# EAGLE design pontEnH (EAGLE 4.16)
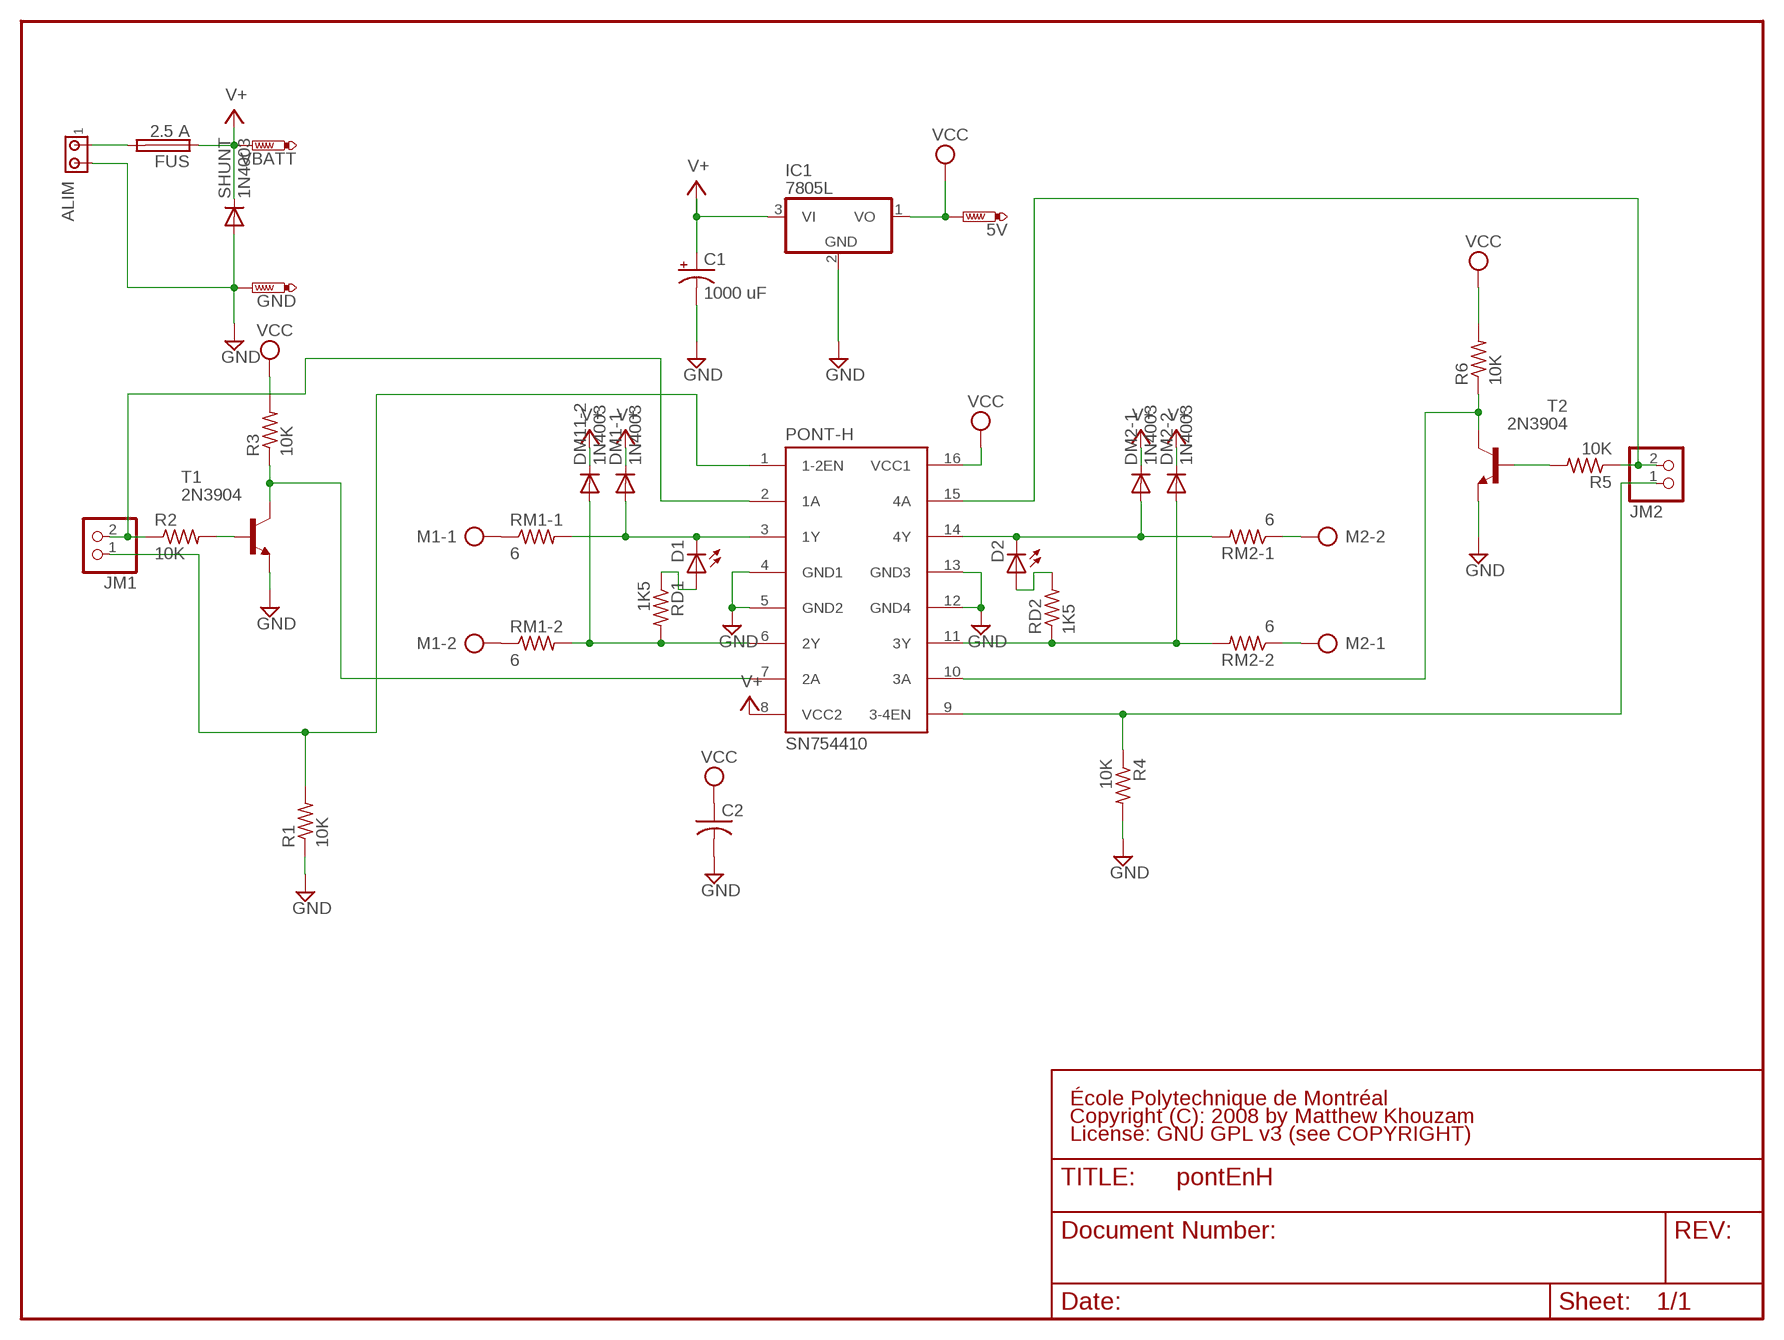
[diagram p0: schematic, sheet 1]

## Parts
5V  keystone_tp  PTR1PAD1-13  [P1-13]
ALIM  MTA02-100  [10X02MTA]
C1  1000 uF  CPOL-USE5-10.5  [E5-10,5]
C2  C-US050-030X075  [C050-030X075]
D1  LED5MM  [LED5MM]
D2  LED5MM  [LED5MM]
DM1-1  1N4003  1N4004  [DO41-10]
DM2-1  1N4003  1N4004  [DO41-10]
DM2-2  1N4003  1N4004  [DO41-10]
DM11-2  1N4003  1N4004  [DO41-10]
FUS  2.5 A  TR5  [TR5]
GND  keystone_tp  PTR1PAD1-13  [P1-13]
IC1  7805L  [TO92]
JM1  PINHD-1X2  [1X02]
JM2  PINHD-1X2  [1X02]
M1  AK300/2  [AK300/2]
M2  AK300/2  [AK300/2]
PONT-H  SN754410  L293E  [DIL16]
R1  10K  R-US_0207/10  [0207/10]
R2  10K  R-US_0207/10  [0207/10]
R3  10K  R-US_0207/10  [0207/10]
R4  10K  R-US_0207/10  [0207/10]
R5  10K  R-US_0207/10  [0207/10]
R6  10K  R-US_0207/10  [0207/10]
RD1  1K5  R-US_0207/10  [0207/10]
RD2  1K5  R-US_0207/10  [0207/10]
RM1-1  6  R-US_0613/5V  [P0613V]
RM1-2  6  R-US_0613/5V  [P0613V]
RM2-1  6  R-US_0613/5V  [P0613V]
RM2-2  6  R-US_0613/5V  [P0613V]
SHUNT  1N4003  1N4004  [DO41-10]
T1  2N3904  [TO92]
T2  2N3904  [TO92]
VBATT  keystone_tp  PTR1PAD1-13  [P1-13]

## Nets
_DIRG: PONT-H.10(3A) R6.1 T2.1(C)
EN-GAU: JM2.1 PONT-H.9(3-4EN) R4.1
EN_DR: JM1.1 PONT-H.1(1-2EN) R1.2
GND: ALIM.2 C1.- C2.2 GND.1(TP) IC1.2(GND) PONT-H.4(GND1) PONT-H.5(GND2) PONT-H.12(GND4) PONT-H.13(GND3) R1.1 R4.2 SHUNT.A T1.3(E) T2.3(E)
N$1: M2.2 RM2-1.1
N$2: M2.1 RM2-2.1
N$3: DM2-2.A PONT-H.11(3Y) RD2.1 RM2-2.2
N$5: D1.K(C) DM1-1.A PONT-H.3(1Y) RM1-1.2
N$7: M1.2 RM1-2.1
N$8: M1.1 RM1-1.1
N$9: D1.A RD1.1
N$10: D2.A RD2.2
N$11: DM11-2.A PONT-H.6(2Y) RD1.2 RM1-2.2
N$12: ALIM.1 FUS.2
N$13: D2.K(C) DM2-1.A PONT-H.14(4Y) RM2-1.2
N$14: PONT-H.7(2A) R3.1 T1.1(C)
N$15: R2.2 T1.2(B)
N$16: R5.2 T2.2(B)
N$22: JM2.2 PONT-H.15(4A) R5.1
N$23: JM1.2 PONT-H.2(1A) R2.1
V+: C1.+ DM1-1.C DM2-1.C DM2-2.C DM11-2.C FUS.1 IC1.3(VI) PONT-H.8(VCC2) SHUNT.C VBATT.1(TP)
VCC: 5V.1(TP) C2.1 IC1.1(VO) PONT-H.16(VCC1) R3.2 R6.2

## Notes on the sheet
- École Polytechnique de Montréal
- Copyright (C): 2008 by Matthew Khouzam
- License: GNU GPL v3 (see COPYRIGHT)

## Library data of the parts
5V GND VBATT = testpad:PTR1: TEST PIN
ALIM = con-amp:MTA02-100: AMP connector
C1 = rcl:CPOL-US: POLARIZED CAPACITOR, American symbol
C2 = rcl:C-US: CAPACITOR, American symbol
D1 D2 = led:LED: LED OSRAM: - CHIPLED LG R971, LG N971, LY N971, LG Q971, LY Q971, LO R971, LY R971 LH N974, LH R974 LS Q976, LO Q976, LY Q976 LO Q996 - Hyper CHIPLED LW Q18S LB Q993, LB Q99A, LB R99A - SideLED LS A670, LO A670, LY A670, LG A670, LP A670 LB A673, LV A673, LT A673, LW A673 LH A674 LY A675 LS A676, LA A676, LO A676, LY A676, LW A676 LS A679, LY A679, LG A679 - Hyper Micro SIDELED® LS Y876, LA Y876, LO Y876, LY Y876 LT Y87S - SmartLED LW L88C, LW L88S LB L89C, LB L89S, LG L890 LS L89K, LO L89K, LY L89K LS L896, LA L896, LO L896, LY L896 - TOPLED LS T670, LO T670, LY T670, LG T670, LP T670 LSG T670, LSP T670, LSY T670, LOP T670, LYG T670 LG T671, LOG T671, LSG T671 LB T673, LV T673, LT T673, LW T673 LH T674 LS T676, LA T676, LO T676, LY T676, LB T676, LH T676, LSB T676, LW T676 LB T67C, LV T67C, LT T67C, LS T67K, LO T67K, LY T67K, LW E67C LS E67B, LA E67B, LO E67B, LY E67B, LB E67C, LV E67C, LT E67C LW T67C LS T679, LY T679, LG T679 LS T770, LO T770, LY T770, LG T770, LP T770 LB T773, LV T773, LT T773, LW T773 LH T774 LS E675, LA E675, LY E675, LS T675 LS T776, LA T776, LO T776, LY T776, LB T776 LHGB T686 LT T68C, LB T68C - Hyper Mini TOPLED® LB M676 - Mini TOPLED Santana® LG M470 LS M47K, LO M47K, LY M47K Source: http://www.osram.convergy.de/
DM1-1 DM2-1 DM2-2 DM11-2 SHUNT = diode:1N4004: DIODE general purpose rectifier, 1 A
FUS = fuse:TR5: FUSE Wickmann
IC1 = linear:78*: Positive VOLTAGE REGULATOR Source: http://cache.national.com/ds/LM/LM78L05.pdf http://www.fairchildsemi.com/ds/LM/LM7805.pdf
JM1 JM2 = pinhead:PINHD-1X2: PIN HEADER
M1 M2 = con-ptr500:AK300/2: CONNECTOR
PONT-H = texas:L293E: TI DEVICE
R1-R6 RD1 RD2 RM1-1 RM1-2 RM2-1 RM2-2 = rcl:R-US_: RESISTOR, American symbol
T1 T2 = transistor:2N3904: NPN TRANSISTOR

## Board
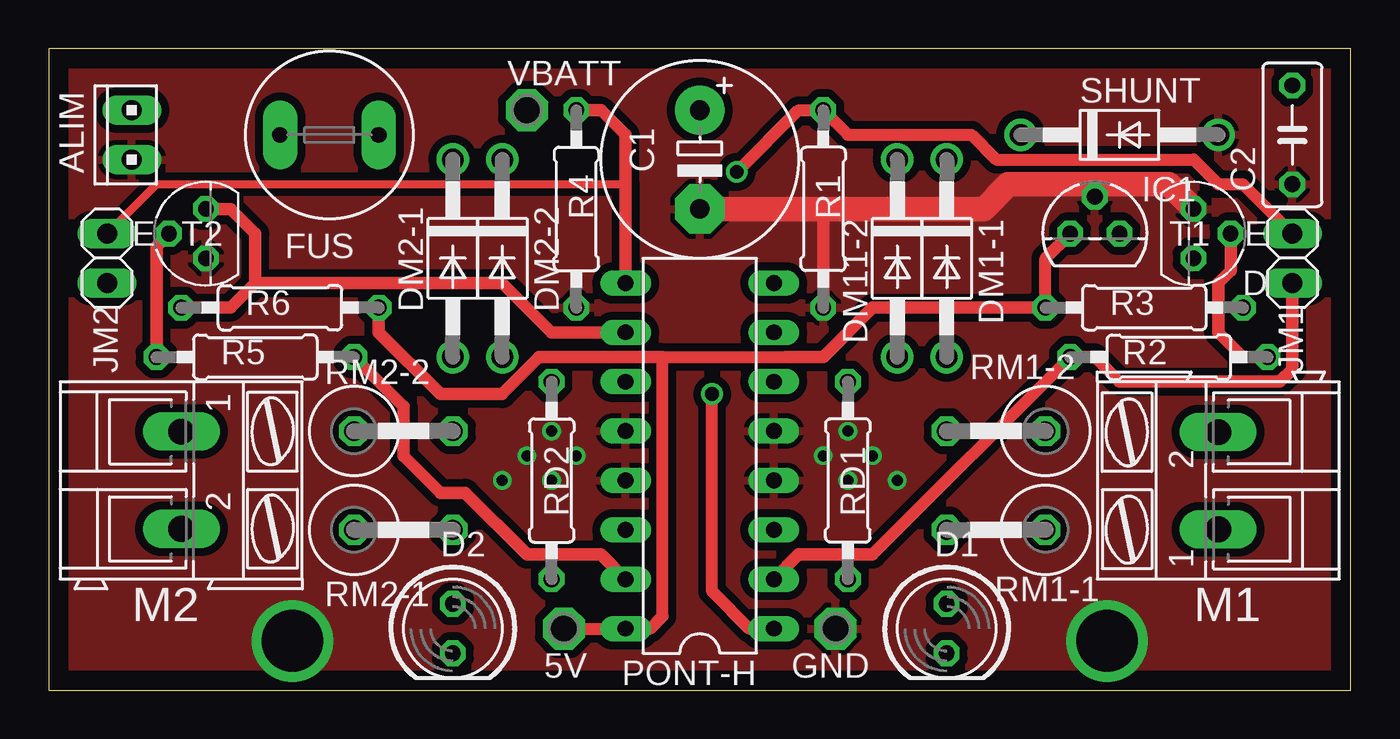
[diagram p1: board, top side]
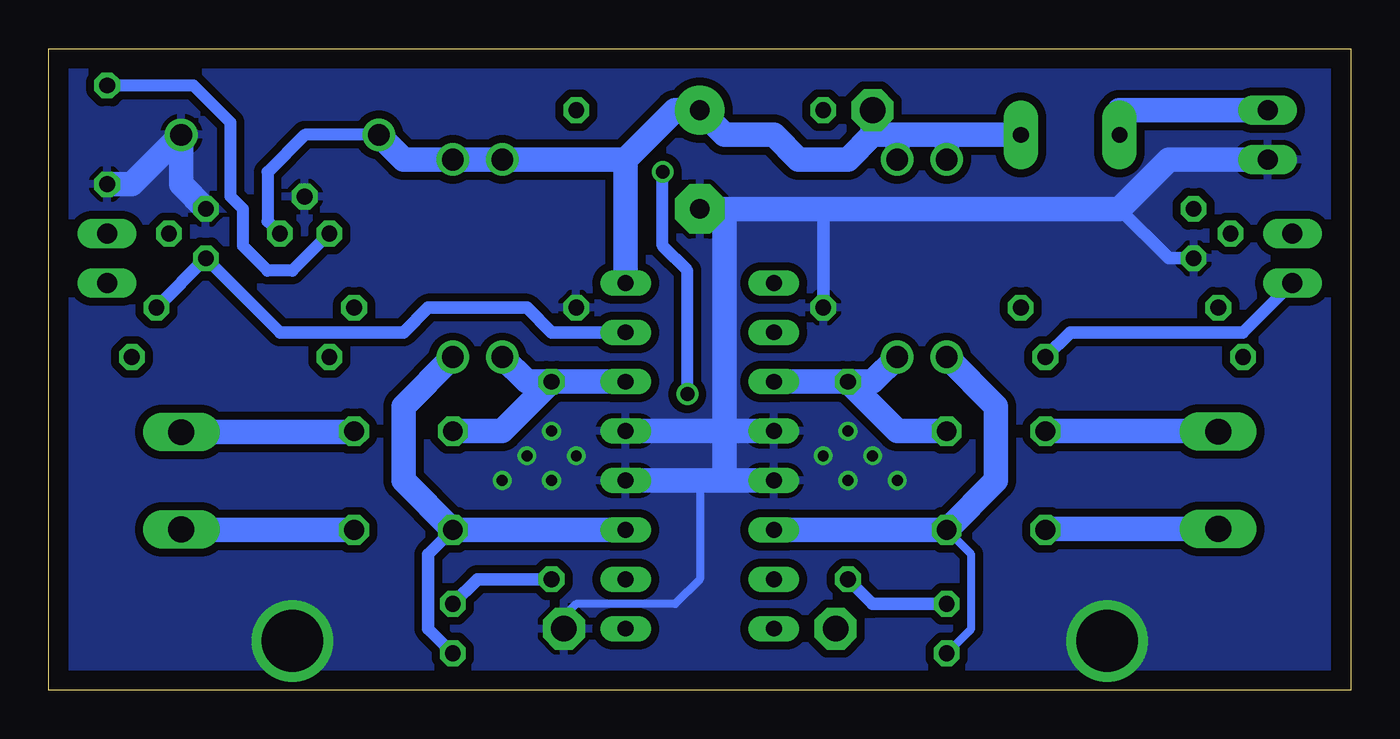
[diagram p2: board, bottom side, seen from below]

Size 66.98 x 33.01 mm. Coordinates in mm from the lower left corner, seen from the top.
Outline: 0,0 66.98,0 66.98,33.01 0,33.01 0,0
Copper layers (1*16): Top 0.035mm / dielectric 1.5mm / Bottom 0.035mm
Design rules "default": minimum track width 10mil, minimum drill 24mil, track to track 8mil, track to pad 8mil, pad to pad 8mil, via to via 8mil, smd to smd 8mil, copper to edge 40mil, drill to drill 8mil, minimum pad ring 10mil, minimum via ring 8mil, stop-mask expansion 4mil, vias tented up to drill 0mil, thermal gap 10mil

### Footprints (pad centres in the part's own frame; a part is rotated, then mirrored left to right if it is on the bottom)
P1-13 = drill 1.321 pad 2.159 octagon: 1 0,0
10X02MTA = drill 1.016 long: 1 1.27,0; 2 -1.27,0
E5-10,5 = drill 1.016 pad 2.54 round: + -2.54,0 | drill 1.016 pad 2.54 octagon: - 2.54,0
C050-030X075 = drill 0.813 octagon: 1 -2.54,0; 2 2.54,0
LED5MM = drill 0.813 octagon: A -1.27,0; K 1.27,0
DO41-10 = drill 1.118 round: A 5.08,0; C -5.08,0
TR5 = drill 0.813 pad 1.778 long: 1 -2.54,0; 2 2.54,0
TO92 = drill 0.813 octagon: 1 -1.27,0; 2 0,1.905; 3 1.27,0
1X02 = drill 1.016 long: 1 -1.27,0; 2 1.27,0
AK300/2 = drill 1.321 long: 1 -2.515,0; 2 2.489,0
DIL16 = drill 0.813 long: 1 -8.89,-3.81; 2 -6.35,-3.81; 3 -3.81,-3.81; 4 -1.27,-3.81; 5 1.27,-3.81; 6 3.81,-3.81; 7 6.35,-3.81; 8 8.89,-3.81; 9 8.89,3.81; 10 6.35,3.81; 11 3.81,3.81; 12 1.27,3.81; 13 -1.27,3.81; 14 -3.81,3.81; 15 -6.35,3.81; 16 -8.89,3.81
0207/10 = drill 0.813 octagon: 1 -5.08,0; 2 5.08,0
P0613V = drill 1.016 octagon: 1 -2.54,0; 2 2.54,0
TO92' = drill 0.813 octagon: 1 1.27,0; 2 0,1.905; 3 -1.27,0

### Placement (x,y rotation side)
5V  26.5,3.17 0 top
ALIM  4.28,28.57 90 top
C1  33.49,27.3 270 top
C2  63.97,28.57 270 top
D1  46.19,3.17 270 top
D2  20.79,3.17 270 top
DM1-1  46.19,22.22 270 top
DM2-1  20.79,22.22 270 top
DM2-2  23.33,22.22 270 top
DM11-2  43.65,22.22 270 top
FUS  14.44,28.57 180 top
GND  40.48,3.17 0 top
IC1  53.81,23.49 0 top
JM1  63.97,22.22 270 top
JM2  3.01,22.22 270 top
M1  60.16,10.79 90 top
M2  6.82,10.79 270 top
PONT-H  33.49,12.06 90 top
R1  39.84,24.76 90 top
R2  57.62,17.14 0 top
R3  56.35,19.68 180 top
R4  27.14,24.76 270 top
R5  10.63,17.14 180 top
R6  11.9,19.68 0 top
RD1  41.11,10.79 90 top
RD2  25.87,10.79 270 top
RM1-1  48.73,8.25 180 top
RM1-2  48.73,13.33 180 top
RM2-1  18.25,8.25 0 top
RM2-2  18.25,13.33 0 top
SHUNT  55.08,28.57 0 top
T1  2N3904  [TO92']  58.89,23.49 270 top
T2  2N3904  [TO92']  8.09,23.49 90 top
VBATT  24.6,29.84 0 top

### Tracks (layer width: path | path; a pad name or v marks a point on that pad's centre or on a via)
_DIRG
  Top 0.635: R6.1 9.36,19.68 10.63,20.95 | 10.63,20.95 10.63,23.49 9.36,24.76 T2.1 | PONT-H.10 25.87,18.41 23.33,20.95 10.63,20.95
EN-GAU
  Top 0.406: 29.68,26.03 5.55,26.03 JM2.1
  Top 0.635: R4.1 28.41,29.84 29.68,28.57 29.68,26.03 PONT-H.9
EN_DR  (via drill 0.71)
  Top 0.61: PONT-H.1 36.03,3.17 34.12,5.08 v34.12,15.24 | v35.39,26.66 38.57,29.84 R1.2 41.11,28.57 47.46,28.57 48.73,27.3 58.89,27.3 60.16,26.03 61.43,26.03 JM1.1
  Bottom 0.61: v34.12,15.24 34.12,21.58 35.39,22.86 v35.39,26.66
GND  (via drill 0.56, 3.17)
  Top 0.635: 39.84,24.76 R1.1
  Top 1.27: T1.3 57.62,26.03 53.81,26.03 | 53.81,26.03 IC1.2 | 53.81,26.03 49.37,26.03 48.09,24.76 39.84,24.76 C1.-
  Bottom 0.406: 32.22,10.79 33.49,10.79 33.49,5.71 34.76,4.44 39.84,4.44 40.48,3.8 GND.1
  Bottom 0.635: T2.3 9.36,22.22 11.9,24.76 | 27.14,24.76 R4.2
  Bottom 1.27: 32.22,10.79 PONT-H.13 | 32.22,10.79 PONT-H.4 | 32.22,13.33 PONT-H.5 | 32.22,13.33 32.22,10.79 | C2.2 62.7,26.03 SHUNT.A 60.16,26.03 T1.3 | 32.22,13.33 PONT-H.12 | 32.22,13.33 32.22,24.76 C1.- 27.14,24.76 11.9,24.76 9.36,27.3 ALIM.2
  other vias: 12.54,2.54 54.45,2.54 27.14,12.06 39.84,12.06 41.11,10.79 41.11,13.33 25.87,10.79 25.87,13.33 24.6,12.06 42.38,12.06 43.65,10.79 23.33,10.79
  pour Bottom (isolate 0.406): 0.47,32.38 66.51,32.38 66.51,0.63 0.47,0.63
  pour Top (isolate 0.406): 0.47,32.38 66.51,32.38 66.51,0.63 0.47,0.63
N$1
  Bottom 1.27: M2.2 15.66,8.3 RM2-1.1
N$2
  Bottom 1.27: M2.1 6.82,13.33 RM2-2.1
N$3
  Bottom 1.27: RD2.1 PONT-H.11 | RD2.1 23.33,13.33 RM2-2.2 | DM2-2.A 24.6,15.87 RD2.1
N$5
  Bottom 0.635: RM1-1.2 47.46,6.98 47.46,3.17 D1.K
  Bottom 1.27: PONT-H.3 RM1-1.2 48.73,10.79 48.73,14.6 DM1-1.A
N$7
  Bottom 1.27: M1.2 51.32,13.28 RM1-2.1
N$8
  Bottom 1.27: M1.1 60.16,8.25 RM1-1.1
N$9
  Bottom 0.635: D1.A 44.92,5.71 RD1.1
N$10
  Bottom 0.635: D2.A 24.6,4.44 RD2.2
N$11
  Bottom 1.27: RM1-2.2 43.65,13.33 RD1.2 | PONT-H.6 RD1.2 | DM11-2.A 42.38,15.87 RD1.2
N$12
  Bottom 1.27: ALIM.1 11.9,29.84 FUS.2
N$13
  Bottom 0.406: D2.K 19.52,3.17 19.52,6.98 RM2-1.2
  Bottom 1.27: PONT-H.14 RM2-1.2 18.25,10.79 18.25,14.6 DM2-1.A
N$14
  Bottom 0.635: R3.1 T1.1 55.08,18.41 48.73,18.41 47.46,19.68 42.38,19.68 41.11,18.41 PONT-H.7
N$15
  Top 0.635: T1.2 60.8,21.58 60.16,20.95 60.16,18.41 61.43,17.14 R2.2
N$16
  Top 0.635: T2.2 5.55,22.86 R5.2
N$22
  Top 0.635: PONT-H.15 28.41,6.98 24.6,6.98 21.42,10.16 20.15,10.16 18.25,12.06 18.25,14.6 R5.1
  Bottom 0.635: JM2.2 5.55,18.41 14.44,18.41 R5.1
N$23
  Top 0.635: PONT-H.2 38.57,6.98 42.38,6.98 R2.1 53.81,17.14 55.08,15.87 63.34,15.87 63.97,16.5 JM1.2
V+
  Bottom 0.61: IC1.3 55.71,24.12 55.71,26.66 53.81,28.57 SHUNT.C
  Bottom 1.27: FUS.1 20.79,28.57 | 20.79,28.57 23.33,28.57 | 23.33,28.57 24.6,28.57 | 24.6,28.57 VBATT.1 | 20.79,28.57 DM2-1.C | 23.33,28.57 DM2-2.C | 24.6,28.57 25.87,27.3 28.41,27.3 29.68,28.57 32.22,28.57 C1.+ 34.76,29.84 37.3,27.3 | 37.3,27.3 PONT-H.8 | 37.3,27.3 DM11-2.C DM1-1.C 48.73,27.3 SHUNT.C
VCC
  Top 0.61: 37.94,17.14 31.58,17.14 31.58,3.8 30.95,3.17 PONT-H.16 5V.1 | IC1.1 51.27,22.22 R3.2
  Top 0.635: 37.94,17.14 39.84,17.14 42.38,19.68 R3.2 | R6.2 16.98,18.41 20.15,15.24 23.33,15.24 25.23,17.14 31.58,17.14
  Bottom 0.61: IC1.1 54.45,21.58 55.71,21.58 56.98,22.86 56.98,24.76 57.62,25.39 57.62,29.2 59.52,31.11 C2.1

### Text on the board
tPlace: E | E | D
tValues: + | D